# Altium schematic sheet TD4-CORE.SchDoc
size A2
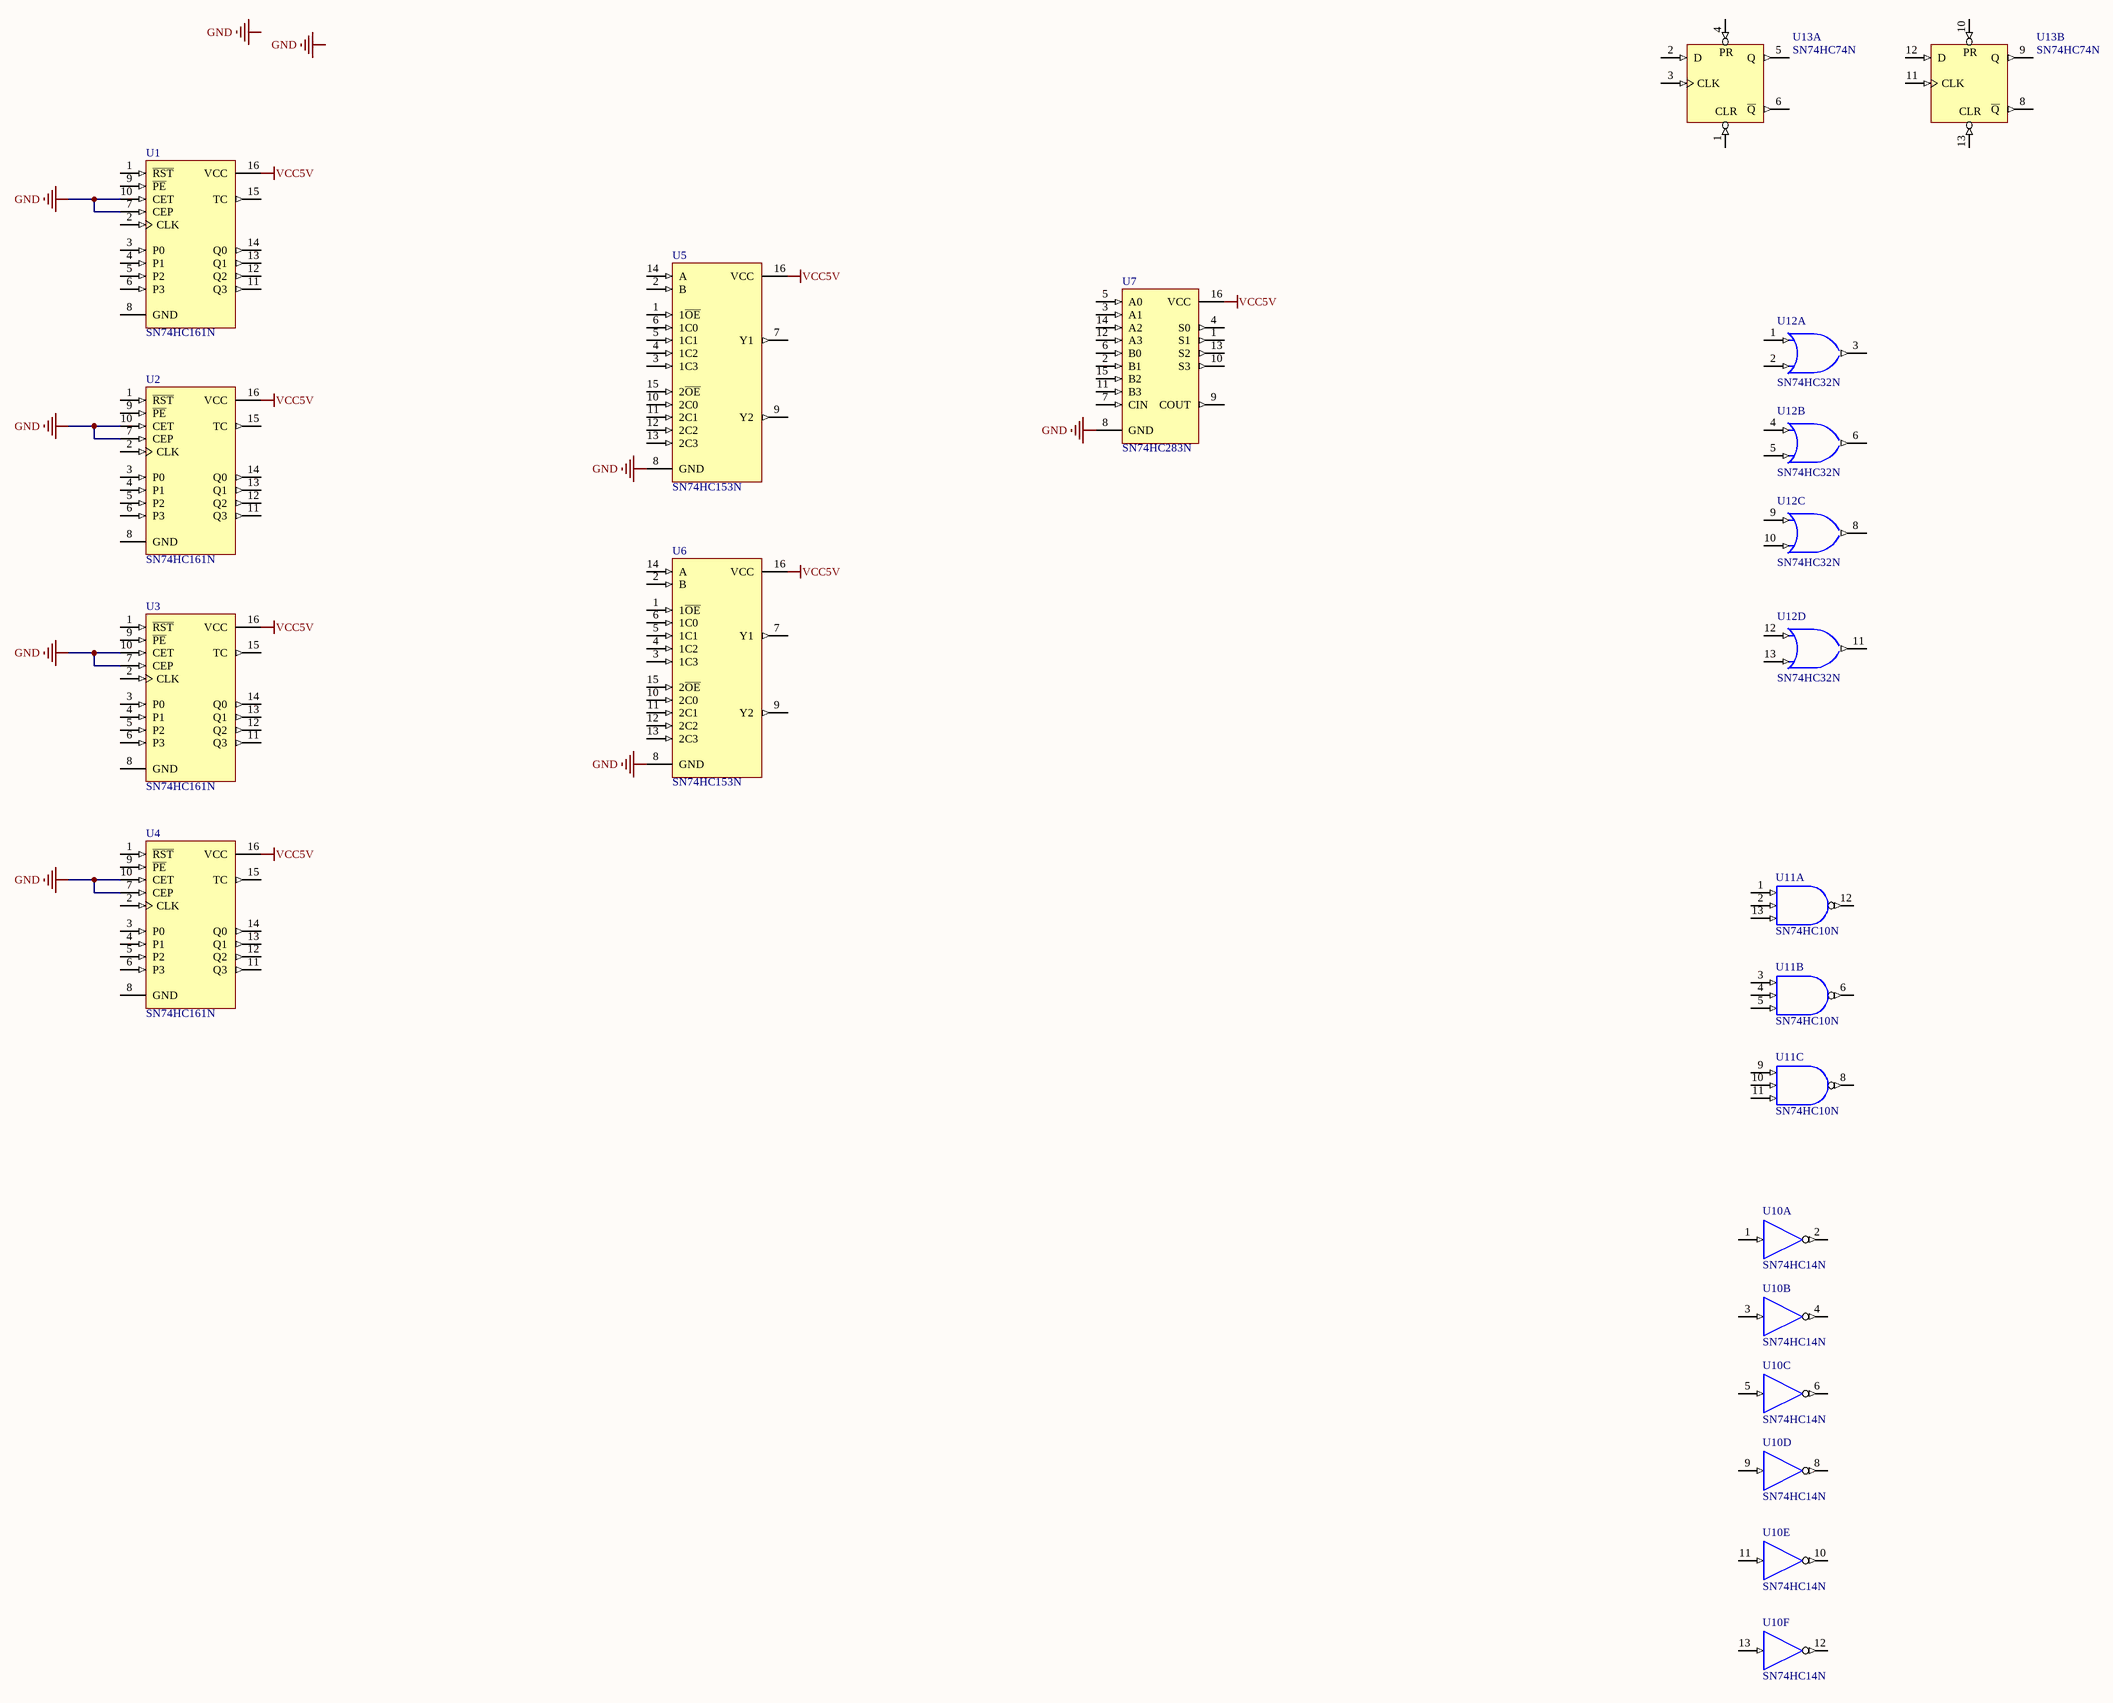
[diagram p0: TD4-CORE.SchDoc]

## Parts
U1  SN74HC161N  [N016]
U2  SN74HC161N  [N016]
U3  SN74HC161N  [N016]
U4  SN74HC161N  [N016]
U5  SN74HC153N  [N016]
U6  SN74HC153N  [N016]
U7  SN74HC283N  [N016]
U10  SN74HC14N  [N014]  (parts A,B,C,D,E,F of 6)
U11  SN74HC10N  [N014]  (parts A,B,C of 3)
U12  SN74HC32N  [N014]  (parts A,B,C,D of 4)
U13  SN74HC74N  [N014]  (parts A,B of 2)

## Nets
GND: U1.7(CEP) U1.10(CET) U2.7(CEP) U2.10(CET) U3.7(CEP) U3.10(CET) U4.7(CEP) U4.10(CET) U5.8(GND) U6.8(GND) U7.8(GND) U10.7(GND) U11.7(GND) U12.7(GND) U13.7(GND)
VCC: U10.14(VCC) U11.14(VCC) U12.14(VCC) U13.14(VCC)
VCC5V: U1.16(VCC) U2.16(VCC) U3.16(VCC) U4.16(VCC) U5.16(VCC) U6.16(VCC) U7.16(VCC)

Not connected (* = marked no-connect by the designer): U1 1(~{RST}) 2(CLK) 3(P0) 4(P1) 5(P2) 6(P3) 8(GND) 9(~{PE}) 11(Q3) 12(Q2) 13(Q1) 14(Q0) 15(TC); U2 1(~{RST}) 2(CLK) 3(P0) 4(P1) 5(P2) 6(P3) 8(GND) 9(~{PE}) 11(Q3) 12(Q2) 13(Q1) 14(Q0) 15(TC); U3 1(~{RST}) 2(CLK) 3(P0) 4(P1) 5(P2) 6(P3) 8(GND) 9(~{PE}) 11(Q3) 12(Q2) 13(Q1) 14(Q0) 15(TC); U4 1(~{RST}) 2(CLK) 3(P0) 4(P1) 5(P2) 6(P3) 8(GND) 9(~{PE}) 11(Q3) 12(Q2) 13(Q1) 14(Q0) 15(TC); U5 1(1~{OE}) 2(B) 3(1C3) 4(1C2) 5(1C1) 6(1C0) 7(Y1) 9(Y2) 10(2C0) 11(2C1) 12(2C2) 13(2C3) 14(A) 15(2~{OE}); U6 1(1~{OE}) 2(B) 3(1C3) 4(1C2) 5(1C1) 6(1C0) 7(Y1) 9(Y2) 10(2C0) 11(2C1) 12(2C2) 13(2C3) 14(A) 15(2~{OE}); U7 1(S1) 2(B1) 3(A1) 4(S0) 5(A0) 6(B0) 7(CIN) 9(COUT) 10(S3) 11(B3) 12(A3) 13(S2) 14(A2) 15(B2); U10 1(A) 2(Y) 3(A) 4(Y) 5(A) 6(Y) 8(Y) 9(A) 10(Y) 11(A) 12(Y) 13(A); U11 1(A) 2(B) 3(A) 4(B) 5(C) 6(Y) 8(Y) 9(A) 10(B) 11(C) 12(Y) 13(C); U12 1(A) 2(B) 3(Y) 4(A) 5(B) 6(Y) 8(Y) 9(A) 10(B) 11(Y) 12(A) 13(B); U13 1(CLR) 2(D) 3(CLK) 4(PR) 5(Q) 6(~{Q}) 8(~{Q}) 9(Q) 10(PR) 11(CLK) 12(D) 13(CLR)

## Notes on the sheet
- Labels drawn without touching a wire or pin: GND

## Library data of the parts
U1-U4 = SN74HC161N: 4-Bit Synchronous Binary Counter; Published: 8-Jun-2000; LatestRevisionDate: 04-Mar-2005; LatestRevisionNote: Stylized 3D Model Added.; DatasheetVersion: May-1997; PackageVersion: Oct-1995; PackageReference: N016; Publisher: Altium Limited; PackageDescription: DIP; 16 Leads; Row Spacing 7.62 mm; Pitch 2.54 mm; Code_JEDEC: MS-001-BB; ComponentLink1Description: Manufacturer Link; ComponentLink1URL: http://www.ti.com/; ComponentLink2Description: Datasheet; ComponentLink2URL: http://www-s.ti.com/sc/ds/sn74hc161.pdf
U5 U6 = SN74HC153N: Dual 4-Line to 1-Line Data Selector/Multiplexer; Published: 8-Jun-2000; LatestRevisionDate: 04-Mar-2005; LatestRevisionNote: Stylized 3D Model Added.; DatasheetVersion: May-1997; PackageVersion: Oct-1995; PackageReference: N016; Publisher: Altium Limited; PackageDescription: DIP; 16 Leads; Row Spacing 7.62 mm; Pitch 2.54 mm; Code_JEDEC: MS-001-BB; ComponentLink1Description: Manufacturer Link; ComponentLink1URL: http://www.ti.com/; ComponentLink2Description: Datasheet; ComponentLink2URL: http://www-s.ti.com/sc/ds/sn74hc153.pdf
U7 = SN74HC283N: 4-Bit Binary Full Adder with Fast Carry; ComponentAvailability: Obsolete; Published: 8-Jun-2000; LatestRevisionDate: 04-Mar-2005; LatestRevisionNote: Stylized 3D Model Added.; DatasheetVersion: Sep-1987; PackageVersion: Oct-1995; PackageReference: N016; Publisher: Altium Limited; PackageDescription: DIP; 16 Leads; Row Spacing 7.62 mm; Pitch 2.54 mm; Code_JEDEC: MS-001-BB; ComponentLink1Description: Manufacturer Link; ComponentLink1URL: http://www.ti.com; ComponentLink2Description: Datasheet; ComponentLink2URL: http://www-s.ti.com/sc/ds/sn74hc283.pdf
U10 = SN74HC14N: Hex Schmitt-Trigger Inverter; Published: 8-Jun-2000; LatestRevisionDate: 04-Mar-2005; LatestRevisionNote: Stylized 3D Model Added.; DatasheetVersion: May-1997; PackageVersion: Oct-1995; PackageReference: N014; Publisher: Altium Limited; PackageDescription: DIP; 14 Leads; Row Spacing 7.62 mm; Pitch 2.54 mm; ComponentLink1Description: Manufacturer Link; ComponentLink1URL: http://www.ti.com/; ComponentLink2Description: Datasheet; ComponentLink2URL: http://www-s.ti.com/sc/ds/sn74hc14.pdf
U11 = SN74HC10N: Triple 3-Input Positive-NAND Gate; Published: 8-Jun-2000; LatestRevisionDate: 04-Mar-2005; LatestRevisionNote: Stylized 3D Model Added.; DatasheetVersion: May-1997; PackageVersion: Oct-1995; PackageReference: N014; Publisher: Altium Limited; PackageDescription: DIP; 14 Leads; Row Spacing 7.62 mm; Pitch 2.54 mm; ComponentLink1Description: Manufacturer Link; ComponentLink1URL: http://www.ti.com/; ComponentLink2Description: Datasheet; ComponentLink2URL: http://www-s.ti.com/sc/ds/sn74hc10.pdf
U12 = SN74HC32N: Quadruple 2-Input Positive-OR Gate; Published: 8-Jun-2000; LatestRevisionDate: 04-Mar-2005; LatestRevisionNote: Stylized 3D Model Added.; DatasheetVersion: May-1997; PackageVersion: Oct-1995; PackageReference: N014; Publisher: Altium Limited; PackageDescription: DIP; 14 Leads; Row Spacing 7.62 mm; Pitch 2.54 mm; ComponentLink1Description: Manufacturer Link; ComponentLink1URL: http://www.ti.com/; ComponentLink2Description: Datasheet; ComponentLink2URL: http://www-s.ti.com/sc/ds/sn74hc32.pdf
U13 = SN74HC74N: Dual D-Type Positive-Edge-Triggered Flip-Flop with Clear and Preset; Published: 8-Jun-2000; LatestRevisionDate: 04-Mar-2005; LatestRevisionNote: Stylized 3D Model Added.; DatasheetVersion: May-1997; PackageVersion: Oct-1995; PackageReference: N014; Publisher: Altium Limited; PackageDescription: DIP; 14 Leads; Row Spacing 7.62 mm; Pitch 2.54 mm; ComponentLink1Description: Manufacturer Link; ComponentLink1URL: http://www.ti.com/; ComponentLink2Description: Datasheet; ComponentLink2URL: http://www-s.ti.com/sc/ds/sn74hc74.pdf